# Altium schematic sheet CONN.SchDoc: =ProjectName
size A4; CheckedBy: DatNB; Author: Ven; CompanyName: Nacentech; Organization: IMET
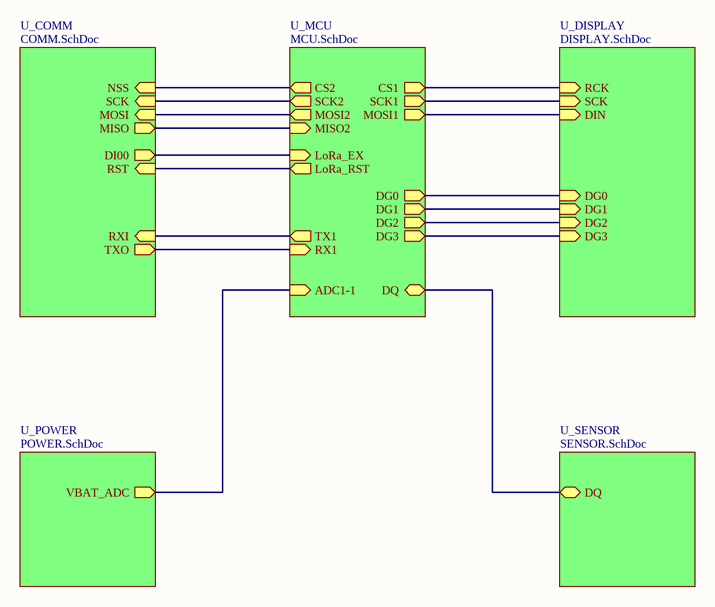
[diagram p0: CONN.SchDoc]

## Sub-sheets
U_COMM = COMM.SchDoc: SCK (in), MISO (out), NSS (in), RST (in), TXO (out), RXI (in), DI00 (out), MOSI (in)
U_DISPLAY = DISPLAY.SchDoc: DIN (in), RCK (in), SCK (in), DG0 (in), DG1 (in), DG2 (in), DG3 (in)
U_MCU = MCU.SchDoc: ADC1-1 (in), CS1 (out), SCK1 (out), MOSI1 (out), CS2 (out), TX1 (out), RX1 (in), LoRa_EX (in), SCK2 (out), MISO2 (in), MOSI2 (out), LoRa_RST (out), DG0 (out), DG2 (out), DG3 (out), DG1 (out), DQ (bidir)
U_POWER = POWER.SchDoc: VBAT_ADC (out)
U_SENSOR = SENSOR.SchDoc: DQ (bidir)

## Nets
(unnamed): sheet U_COMM/SCK, sheet U_MCU/SCK2
(unnamed): sheet U_COMM/MISO, sheet U_MCU/MISO2
(unnamed): sheet U_COMM/NSS, sheet U_MCU/CS2
(unnamed): sheet U_COMM/RST, sheet U_MCU/LoRa_RST
(unnamed): sheet U_COMM/TXO, sheet U_MCU/RX1
(unnamed): sheet U_COMM/RXI, sheet U_MCU/TX1
(unnamed): sheet U_COMM/DI00, sheet U_MCU/LoRa_EX
(unnamed): sheet U_COMM/MOSI, sheet U_MCU/MOSI2
(unnamed): sheet U_DISPLAY/DIN, sheet U_MCU/MOSI1
(unnamed): sheet U_DISPLAY/RCK, sheet U_MCU/CS1
(unnamed): sheet U_DISPLAY/SCK, sheet U_MCU/SCK1
(unnamed): sheet U_DISPLAY/DG0, sheet U_MCU/DG0
(unnamed): sheet U_DISPLAY/DG1, sheet U_MCU/DG1
(unnamed): sheet U_DISPLAY/DG2, sheet U_MCU/DG2
(unnamed): sheet U_DISPLAY/DG3, sheet U_MCU/DG3
(unnamed): sheet U_MCU/ADC1-1, sheet U_POWER/VBAT_ADC
(unnamed): sheet U_MCU/DQ, sheet U_SENSOR/DQ

## Notes on the sheet
- Project:
- Page Contents:
- Size:
- Date:
- A4
- Checked by:
- Time:
- Revision:
- Sheet
- of
- File: